# Altium schematic sheet F217Soc.SchDoc
size A4; Organization: Altium Limited; Address1: L3, 12a Rodborough Rd; Address2: Frenchs Forest; Address3: NSW; Address4: Australia 2086
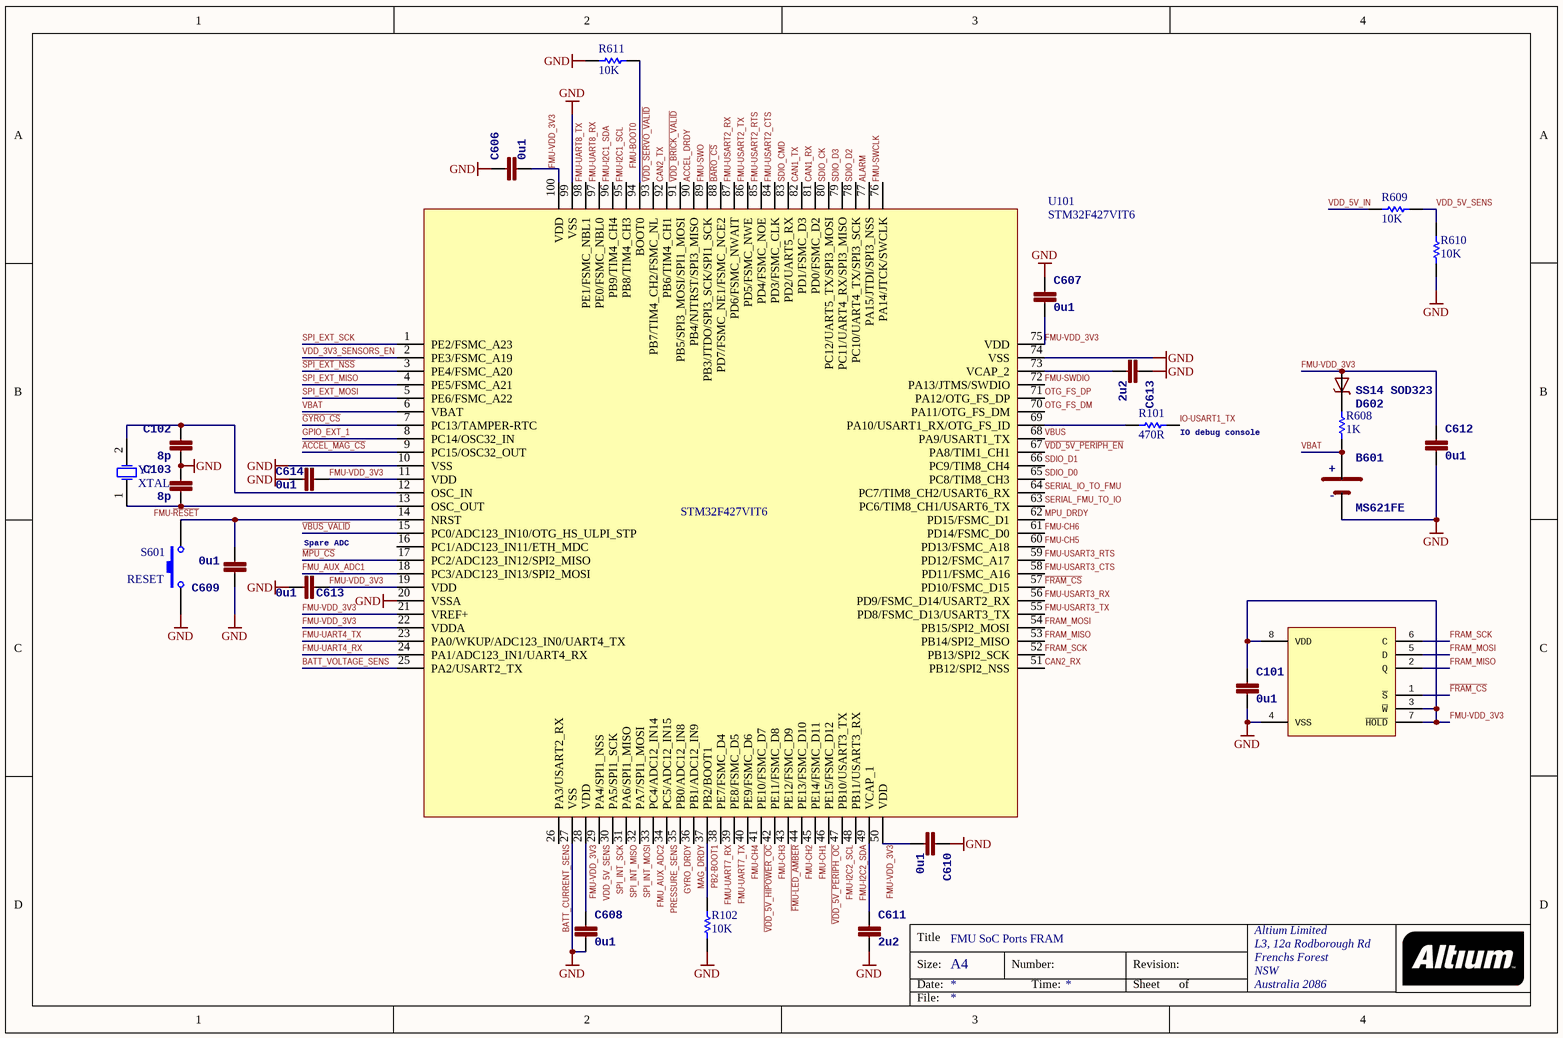
[diagram p0: F217Soc.SchDoc]

## Parts
(Parts that share a designator on the sheet are numbered #1, #2 ... from top to bottom, then left to right.)
B601  >NAME: B601  [MS621FE]  (hidden comment: MS621FE)
C101  >NAME: C101  [0603-CAP]  (hidden comment: 0u1)
C102  >NAME: C102  [0603-CAP]  (hidden comment: 8p)
C103  >NAME: C103  [0603-CAP]  (hidden comment: 8p)
C606  >NAME: C606  [0603-CAP]  (hidden comment: 0u1)
C607  >NAME: C607  [0603-CAP]  (hidden comment: 0u1)
C608#1  >NAME: C614  [0603-CAP]  (hidden comment: 0u1)
C608#2  >NAME: C613  [0603-CAP]  (hidden comment: 0u1)
C608#3  >NAME: C608  [0603-CAP]  (hidden comment: 0u1)
C609  >NAME: C609  [0603-CAP]  (hidden comment: 0u1)
C610  >NAME: C610  [0603-CAP]  (hidden comment: 0u1)
C611  >NAME: C611  [0603-CAP]  (hidden comment: 2u2)
C612  >NAME: C612  [0603-CAP]  (hidden comment: 0u1)
C613  >NAME: C613  [0603-CAP]  (hidden comment: 2u2)
D602  SS14 SOD323  [SOD323]
R101  value 470R  [AXIAL-0.5]  (hidden comment: Res Semi)
R102  value 10K  [AXIAL-0.5]  (hidden comment: Res Semi)
R608  value 1K  [AXIAL-0.5]  (hidden comment: Res Semi)
R609  value 10K  [AXIAL-0.5]  (hidden comment: Res Semi)
R610  value 10K  [AXIAL-0.5]  (hidden comment: Res Semi)
R611  value 10K  [AXIAL-0.5]  (hidden comment: Res Semi)
S601  RESET  [SPST-2]
U101  STM32F427VIT6
U102  FM25V01  [SO08]  (value not drawn)
Y?  XTAL  [R38]

## Nets
GND: B601.2(NEG) C101.P$2 C102.P$2 C103.P$1 C606.P$1 C607.P$1 C608#1.P$2 C608#2.P$1 C608#3.P$2 C609.P$1 C610.P$1 C611.P$2 C612.P$2 C613.P$1 R102.1 R610.1 R611.2 S601.1 U101.10(VSS) U101.20(VSSA) U101.27(VSS) U101.74(VSS) U101.99(VSS) U102.4(VSS)
~{ACCEL_MAG_CS}: U101.9(PC15/OSC32_OUT)
ACCEL_DRDY: U101.90(PB4/NJTRST/SPI3_MISO)
ALARM: U101.77(PA15/JTDI/SPI3_NSS)
~{BARO_CS}: U101.88(PD7/FSMC_NE1/FSMC_NCE2)
BATT_CURRENT_SENS: U101.26(PA3/USART2_RX)
BATT_VOLTAGE_SENS: U101.25(PA2/USART2_TX)
CAN1_RX: U101.81(PD0/FSMC_D2)
CAN1_TX: U101.82(PD1/FSMC_D3)
CAN2_RX: U101.51(PB12/SPI2_NSS)
CAN2_TX: U101.92(PB6/TIM4_CH1)
~{FMU-LED_AMBER}: U101.43(PE12/FSMC_D9)
~{FRAM_CS}: U101.57(PD10/FSMC_D15) U102.1(~{S})
FMU-BOOT0: R611.1 U101.94(BOOT0)
FMU-CH1: U101.45(PE14/FSMC_D11)
FMU-CH2: U101.44(PE13/FSMC_D10)
FMU-CH3: U101.42(PE11/FSMC_D8)
FMU-CH4: U101.40(PE9/FSMC_D6)
FMU-CH5: U101.60(PD13/FSMC_A18)
FMU-CH6: U101.61(PD14/FSMC_D0)
FMU-I2C1_SCL: U101.95(PB8/TIM4_CH3)
FMU-I2C1_SDA: U101.96(PB9/TIM4_CH4)
FMU-I2C2_SCL: U101.47(PB10/USART3_TX)
FMU-I2C2_SDA: U101.48(PB11/USART3_RX)
FMU-SWCLK: U101.76(PA14/JTCK/SWCLK)
FMU-SWDIO: U101.72(PA13/JTMS/SWDIO)
FMU-SWO: U101.89(PB3/JTDO/SPI3_SCK/SPI1_SCK)
FMU-UART4_RX: U101.24(PA1/ADC123_IN1/UART4_RX)
FMU-UART4_TX: U101.23(PA0/WKUP/ADC123_IN0/UART4_TX)
FMU-UART7_RX: U101.38(PE7/FSMC_D4)
FMU-UART7_TX: U101.39(PE8/FSMC_D5)
FMU-UART8_RX: U101.97(PE0/FSMC_NBL0)
FMU-UART8_TX: U101.98(PE1/FSMC_NBL1)
FMU-USART2_CTS: U101.84(PD3/FSMC_CLK)
FMU-USART2_RTS: U101.85(PD4/FSMC_NOE)
FMU-USART2_RX: U101.87(PD6/FSMC_NWAIT)
FMU-USART2_TX: U101.86(PD5/FSMC_NWE)
FMU-USART3_CTS: U101.58(PD11/FSMC_A16)
FMU-USART3_RTS: U101.59(PD12/FSMC_A17)
FMU-USART3_RX: U101.56(PD9/FSMC_D14/USART2_RX)
FMU-USART3_TX: U101.55(PD8/FSMC_D13/USART3_TX)
FMU-VDD_3V3: C101.P$1 C606.P$2 C607.P$2 C608#1.P$1 C608#2.P$2 C608#3.P$1 C610.P$2 C612.P$1 D602.A U101.11(VDD) U101.19(VDD) U101.21(VREF+) U101.22(VDDA) U101.28(VDD) U101.50(VDD) U101.75(VDD) U101.100(VDD) U102.3(~{W}) U102.7(~{HOLD}) U102.8(VDD)
FMU_AUX_ADC1: U101.18(PC3/ADC123_IN13/SPI2_MOSI)
FMU_AUX_ADC2: U101.33(PC4/ADC12_IN14)
FRAM_MISO: U101.53(PB14/SPI2_MISO) U102.2(Q)
FRAM_MOSI: U101.54(PB15/SPI2_MOSI) U102.5(D)
FRAM_SCK: U101.52(PB13/SPI2_SCK) U102.6(C)
~{GYRO_CS}: U101.7(PC13/TAMPER-RTC)
GPIO_EXT_1: U101.8(PC14/OSC32_IN)
GYRO_DRDY: U101.35(PB0/ADC12_IN8)
IO-USART1_TX: R101.1
~{MPU_CS}: U101.17(PC2/ADC123_IN12/SPI2_MISO)
MAG_DRDY: U101.36(PB1/ADC12_IN9)
MPU_DRDY: U101.62(PD15/FSMC_D1)
OTG_FS_DM: U101.70(PA11/OTG_FS_DM)
OTG_FS_DP: U101.71(PA12/OTG_FS_DP)
PB2-BOOT1: R102.2 U101.37(PB2/BOOT1)
PRESSURE_SENS: U101.34(PC5/ADC12_IN15)
~{SPI_EXT_NSS}: U101.3(PE4/FSMC_A20)
SDIO_CK: U101.80(PC12/UART5_TX/SPI3_MOSI)
SDIO_CMD: U101.83(PD2/UART5_RX)
SDIO_D0: U101.65(PC8/TIM8_CH3)
SDIO_D1: U101.66(PC9/TIM8_CH4)
SDIO_D2: U101.78(PC10/UART4_TX/SPI3_SCK)
SDIO_D3: U101.79(PC11/UART4_RX/SPI3_MISO)
SERIAL_FMU_TO_IO: U101.63(PC6/TIM8_CH1/USART6_TX)
SERIAL_IO_TO_FMU: U101.64(PC7/TIM8_CH2/USART6_RX)
SPI_EXT_MISO: U101.4(PE5/FSMC_A21)
SPI_EXT_MOSI: U101.5(PE6/FSMC_A22)
SPI_EXT_SCK: U101.1(PE2/FSMC_A23)
SPI_INT_MISO: U101.31(PA6/SPI1_MISO)
SPI_INT_MOSI: U101.32(PA7/SPI1_MOSI)
SPI_INT_SCK: U101.30(PA5/SPI1_SCK)
~{VBUS_VALID}: U101.15(PC0/ADC123_IN10/OTG_HS_ULPI_STP)
~{VDD_5V_HIPOWER_OC}: U101.41(PE10/FSMC_D7)
~{VDD_5V_PERIPH_EN}: U101.67(PA8/TIM1_CH1)
~{VDD_5V_PERIPH_OC}: U101.46(PE15/FSMC_D12)
~{VDD_BRICK_VALID}: U101.91(PB5/SPI3_MOSI/SPI1_MOSI)
~{VDD_SERVO_VALID}: U101.93(PB7/TIM4_CH2/FSMC_NL)
VBAT: B601.1(POS) R608.1 U101.6(VBAT)
VBUS: U101.68(PA9/USART1_TX)
VDD_3V3_SENSORS_EN: U101.2(PE3/FSMC_A19)
VDD_5V_IN: R609.2
VDD_5V_SENS: R609.1 R610.2 U101.29(PA4/SPI1_NSS)
NetC102_P$1: C102.P$1 U101.12(OSC_IN) Y?.2(OSC2)
NetC103_P$2: C103.P$2 U101.13(OSC_OUT) Y?.1(OSC1)
NetC609_P$2: C609.P$2 S601.2 U101.14(NRST)
NetC611_P$1: C611.P$1 U101.49(VCAP_1)
NetC613_P$2: C613.P$2 U101.73(VCAP_2)
NetD602_C: D602.C R608.2
NetR101_2: R101.2 U101.69(PA10/USART1_RX/OTG_FS_ID)

Not connected (* = marked no-connect by the designer): U101 16(PC1/ADC123_IN11/ETH_MDC)

## Notes on the sheet
- (near R101) IO debug console
- (near C608#2) Spare ADC
- FMU SoC Ports FRAM
- Labels drawn without touching a wire or pin: FMU-~{RESET}
- Title
- Size:
- Date:
- A4
- Number:
- Time:
- Revision:
- Sheet
- of
- File:

## Library data of the parts
B601 = MS621FE: <b>SEIKO 6.8mm Rechargeable 3V lithium battery<b> / <br> / <br> / <b>If discontinued or not available, similar devices are available from Panasonic and Sanyo, usually direct replacements.<b>; PARTNO: MS621FE-FL11E; DATASHEET: http://speed.sii.co.jp/data/file_PRODUCT_MASTER_50112_TITLE_IMAGESP.pdf; LINK: http://search.digikey.com/us/en/products/MS621FE-FL11E/728-1057-ND/1889208; MFGPN: MS621FE; +: +; -: -; >VALUE: MS621FE
C101 C606 C607 C608#1-C608#3 C609 C610 C612 = CAP0402: <b>Capacitor</b> / Standard 0603 ceramic capacitor, and 0.1" leaded capacitor.; PARTNO: CC0402ZRY5V7BB104; >VALUE: 0u1
C102 C103 = CAP0402: <b>Capacitor</b> / Standard 0603 ceramic capacitor, and 0.1" leaded capacitor.; PARTNO: C1005C0G1H080C; >VALUE: 8p
C611 C613 = CAP0603: <b>Capacitor</b> / Standard 0603 ceramic capacitor, and 0.1" leaded capacitor.; PARTNO: C1608X6S1C225K080AC; >VALUE: 2u2
D602 = DIODE-SCHOTTKY_SOD323: Schottky barrier diode in DO214AC, e.g. Fairchild SS14.
R101 R102 R608-R611 = Res Semi: Semiconductor Resistor; Published: 8-Jun-2000; LatestRevisionDate: 17-Jul-2002; LatestRevisionNote: Re-released for DXP Platform.; PackageReference: AXIAL-0.5; Publisher: Altium Limited; PackageDescription: Axial Device, Thru-Hole; 2 Leads; 0.5 in Pin Spacing
S601 = SW-PB: Switch; Published: 24-Mar-1999; LatestRevisionDate: 17-Jul-2002; LatestRevisionNote: Re-released for DXP Platform.; PackageReference: SPST-2; Publisher: Altium Limited; PackageDescription: Switch; 2 Leads
U102 = FM25V01: <b>FM25V01 128Kb Serial 3V F-RAM Memory</b>; PARTNO: FM25V01-G; DATASHEET: http://www.ramtron.com/files/datasheets/FM25V01_ds.pdf; LINK: http://www.digikey.com/product-detail/en/FM25V01-GTR/1140-1026-1-ND/2809832; MFGPN: FM25V01
Y? = XTAL: Crystal Oscillator; Published: 8-Jun-2000; LatestRevisionDate: 17-Jul-2002; LatestRevisionNote: Re-released for DXP Platform.; PackageReference: R38; Publisher: Altium Limited; PackageDescription: Crystal, Thru-Hole; 2 Leads; Body 3.1 x 8.2 mm (Dia.xH)